# Altium schematic sheet External_Housing.SchDoc
size A4
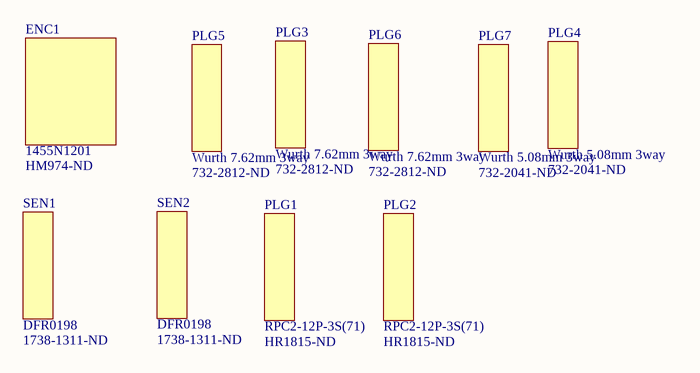
[diagram p0: External_Housing.SchDoc]

## Parts
ENC1  1455N1201  Supplier Part Number 1: HM974-ND
PLG1  RPC2-12P-3S(71)  Supplier Part Number 1: HR1815-ND
PLG2  RPC2-12P-3S(71)  Supplier Part Number 1: HR1815-ND
PLG3  Wurth 7.62mm 3way  Supplier Part Number 1: 732-2812-ND
PLG4  Wurth 5.08mm 3way  Supplier Part Number 1: 732-2041-ND
PLG5  Wurth 7.62mm 3way  Supplier Part Number 1: 732-2812-ND
PLG6  Wurth 7.62mm 3way  Supplier Part Number 1: 732-2812-ND
PLG7  Wurth 5.08mm 3way  Supplier Part Number 1: 732-2041-ND
SEN1  DFR0198  Supplier Part Number 1: 1738-1311-ND
SEN2  DFR0198  Supplier Part Number 1: 1738-1311-ND

## Library data of the parts
ENC1 = 1455N1201: HAMMOND         1455N1201            Enclosure, 1455 Series, Extruded With Metal End Panels, PCB Box, 53 mm, 103 mm, 120 mm, Aluminium; Manufacturer: Hammond Manufacturing; Ratings: IP40; Supplier 1: Digi-Key; Manufacturer Part Number: 1455N1201; RoHS: Yes; Category: Enclosures; Stock 1: 42; Case/Package: Metal; Weight: 0.66lb; Color: Clear,Black,Natural; Material: Aluminium,Metal; Housing Material: Aluminium; Body Material: Aluminium; Package Quantity: 1; Length: 4.724inch; Height: 2.087inch; Width: 4.06inch; Thickness: 0.06inch; REACH SVHC: No SVHC; ComponentLink1URL: https://datasheet.ciiva.com/4630/1455n1201-83616-4630121.pdf?src-supplier=Mouser; ComponentLink1Description: https://datasheet.ciiva.com/4630/1455n1201-83616-4630121.pdf?src-supplier=Mouser; ComponentLink2URL: https://datasheet.ciiva.com/20197/30-1572-20197097.pdf?src-supplier=Rapid+Electronics; ComponentLink2Description: https://datasheet.ciiva.com/20197/30-1572-20197097.pdf?src-supplier=Rapid+Electronics
PLG1 PLG2 = RPC2-12P-3S(71): CONN PLUG 3 POS W/SOCKETS; Manufacturer: Hirose; Number of Positions: 3; Current Rating: 5A; Voltage Rating: 250V; Supplier 1: Digi-Key; Manufacturer Part Number: RPC2-12P-3S(71); RoHS: Yes; Category: Circular Connectors; Stock 1: 1316; Mount: Free Hanging,Cable; Color: Blue; Contact Material: Bronze; Contact Plating: Silver; Insulation Material: Plastic; Shell Material: Plastic; Min Operating Temperature: -10°C; Max Operating Temperature: 60°C; Termination: Solder; Connector Type: Plug; Package Quantity: 50; Fastening Type: Push,Pull; Packaging: Tray; Number of Contacts: 3; Contact Gender: Female; Orientation: Straight; Radiation Hardening: No; Lead Free: Lead Free; ComponentLink1URL: https://datasheet.ciiva.com/549/e11300018-549107.pdf?src-supplier=Digi-Key; ComponentLink1Description: https://datasheet.ciiva.com/549/e11300018-549107.pdf?src-supplier=Digi-Key; ComponentLink2URL: https://datasheet.ciiva.com/3103/e11300018-3103307.pdf?src-supplier=Avnet; ComponentLink2Description: https://datasheet.ciiva.com/3103/e11300018-3103307.pdf?src-supplier=Avnet; ComponentLink3URL: https://datasheet.ciiva.com/16752/e11300018-16752447.pdf?src-supplier=Avnet+Europe; ComponentLink3Description: https://datasheet.ciiva.com/16752/e11300018-16752447.pdf?src-supplier=Avnet+Europe
PLG3 PLG5 PLG6 = Wurth 7.62mm 3way: Socket 3 Poles, 7.62 mm Pitch, 691351400003, Würth Elektronik; Manufacturer: Wurth Electronics; Number of Contacts: 3; Voltage Rating: 300V; Number of Levels: 1; Current: 20A; Wire/Cable Gauge: 24AWG; Pitch: 0.3inch; Wire Gauge (Min): 12AWG; Supplier 1: Digi-Key; Manufacturer Part Number: 691351400003; RoHS: Yes; Category: Terminal Blocks; Stock 1: 167; Mount: Free Hanging; Contact Material: Brass; Color: Green; Termination: Screw; Package Quantity: 130; Packaging: Bulk; Number of Positions Per Level: 3; Voltage: 300V; Current Rating: 20A; Length: 15.1mm; Width: 20.86mm; Wire Gauge (Max): 24AWG; REACH SVHC: Unknown; ComponentLink1URL: https://datasheet.ciiva.com/796/6913514000xx-796220.pdf?src-supplier=Digi-Key; ComponentLink1Description: https://datasheet.ciiva.com/796/6913514000xx-796220.pdf?src-supplier=Digi-Key
PLG4 PLG7 = Wurth 5.08mm 3way: TERM BLOCK PLUG 3POS STR 5.08MM; Manufacturer: Wurth Electronics; Manufacturer Part Number: 691351500003; Current Rating: 20A; Number of Positions Per Level: 3; Number of Levels: 1; Voltage: 300V; Pitch: 0.2inch; Wire/Cable Gauge: 24AWG; Wire Gauge (Min): 12AWG; Supplier 1: Digi-Key; RoHS: Yes; Category: Terminal Blocks; Stock 1: 1970; Mount: Free Hanging; Contact Material: Brass; Color: Green; Termination: Screw; Current: 20A; Number of Contacts: 3; Package Quantity: 250; Packaging: Bulk; Voltage Rating: 300V; Length: 18.2mm; Width: 15.24mm; Wire Gauge (Max): 24AWG; REACH SVHC: Unknown; ComponentLink1URL: https://datasheet.ciiva.com/796/6913515000xx-796335.pdf?src-supplier=Digi-Key; ComponentLink1Description: https://datasheet.ciiva.com/796/6913515000xx-796335.pdf?src-supplier=Digi-Key
SEN1 SEN2 = DFR0198: Waterproof DS18B20 Digital Temperature Sensor for Arduino; Manufacturer: DFRobot; Supplier 1: Digi-Key; Manufacturer Part Number: DFR0198; RoHS: No; Category: Temperature and Humidity Sensors; Stock 1: 602; Min Operating Temperature: -55°C; Max Operating Temperature: 125°C; ComponentLink1URL: https://media.digikey.com/pdf/Data%20Sheets/DFRobot%20PDFs/DFR0198_Web.pdf?src-supplier=Digi-Key; ComponentLink1Description: https://media.digikey.com/pdf/Data%20Sheets/DFRobot%20PDFs/DFR0198_Web.pdf?src-supplier=Digi-Key